# EAGLE design receiver_mini_ra02 (EAGLE 7.7.0)
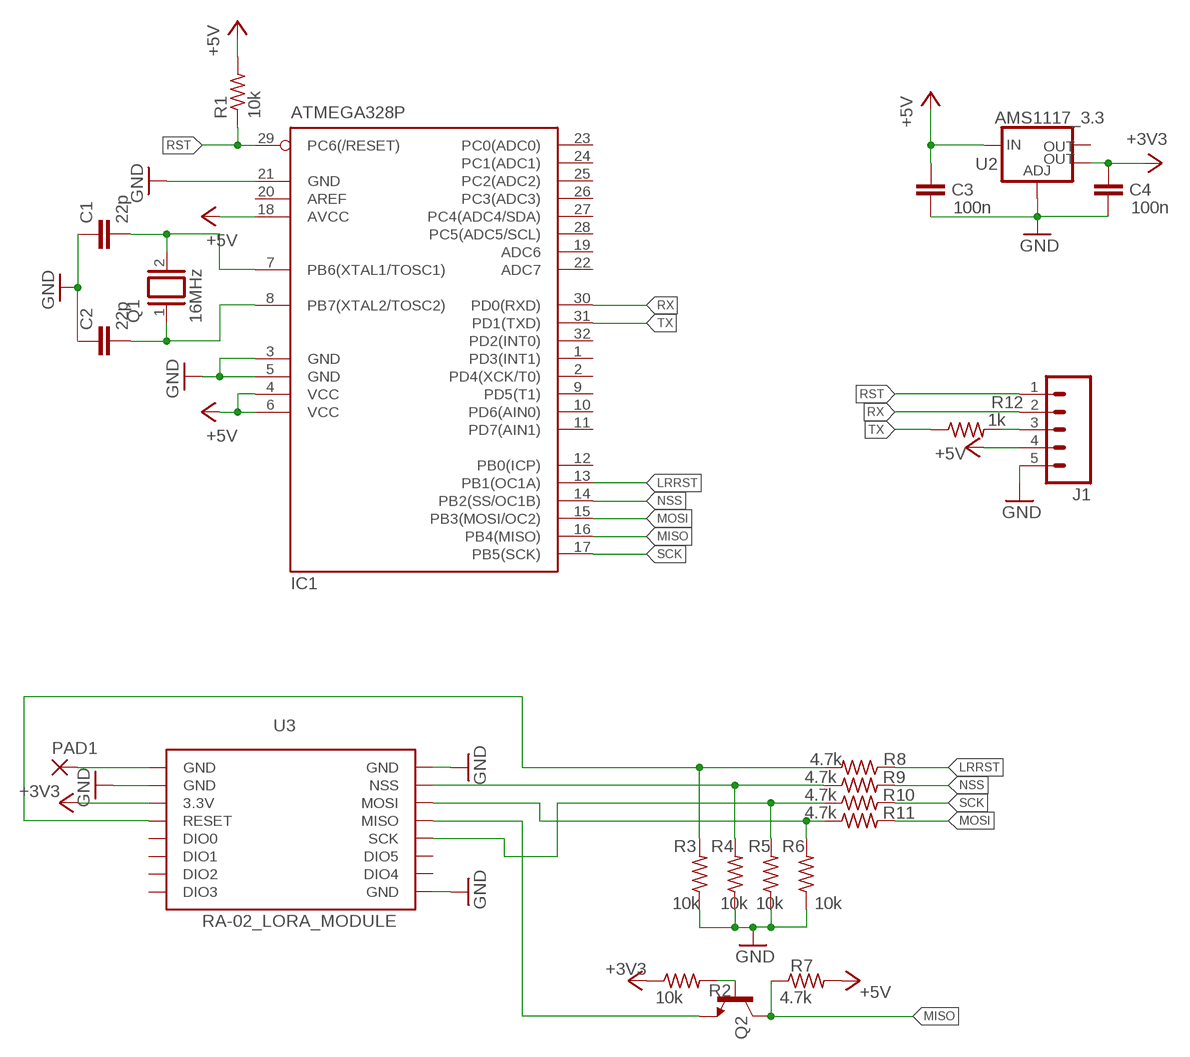
[diagram p0: schematic, sheet 1]

## Parts
C1  22p  C-EUC0805K  [C0805K]
C2  22p  C-EUC0805K  [C0805K]
C3  100n  C-EUC0805K  [C0805K]
C4  100n  C-EUC0805K  [C0805K]
IC1  ATMEGA328P  MEGA8-AI  [TQFP32-08]
J1  M05PTH  [1X05]
PAD1  2,15/1,0  [2,15/1,0]
Q1  16MHz  XTAL/S  [QS]
Q2  BC817-16SMD  [SOT23-BEC]
R1  10k  R-US_R0805  [R0805]
R2  10k  R-US_R0805  [R0805]
R3  10k  R-US_R0805  [R0805]
R4  10k  R-US_R0805  [R0805]
R5  10k  R-US_R0805  [R0805]
R6  10k  R-US_R0805  [R0805]
R7  4.7k  R-US_R0805  [R0805]
R8  4.7k  R-US_R0805  [R0805]
R9  4.7k  R-US_R0805  [R0805]
R10  4.7k  R-US_R0805  [R0805]
R11  4.7k  R-US_R0805  [R0805]
R12  1k  R-US_R0805  [R0805]
U2  AMS1117_3.3  V_REG_LM1117SOT223  [SOT223]
U3  RA-02_LORA_MODULE  [RA-02]

## Nets
+3V3: C4.2 R2.1 U2.4(OUT) U3.3.3V
+5V: C3.2 IC1.4(VCC) IC1.6(VCC) IC1.18(AVCC) J1.4 R1.2 R7.2 U2.3(IN)
GND: C1.1 C2.1 C3.1 C4.1 IC1.3(GND) IC1.5(GND) IC1.21(GND) J1.5 R3.1 R4.1 R5.1 R6.1 U2.1(ADJ) U3.GND@2(GND) U3.GND@3(GND) U3.GND@4(GND)
LRRST: IC1.13(PB1(OC1A)) R8.1
MISO: IC1.16(PB4(MISO)) Q2.C R7.1
MOSI: IC1.15(PB3(MOSI/OC2)) R11.2
N$1: C1.2 IC1.7(PB6(XTAL1/TOSC1)) Q1.2
N$2: J1.3 R12.2
N$3: C2.2 IC1.8(PB7(XTAL2/TOSC2)) Q1.1
N$4: R3.2 R8.2 U3.RESET
N$5: PAD1.1(P) U3.GND
N$6: Q2.E U3.MISO
N$7: R4.2 R9.1 U3.NSS
N$8: R5.2 R10.1 U3.SCK
N$9: R6.2 R11.1 U3.MOSI
N$33: Q2.B R2.2
NSS: IC1.14(PB2(SS/OC1B)) R9.2
RST: IC1.29(PC6(/RESET)) J1.1 R1.1
RX: IC1.30(PD0(RXD)) J1.2
SCK: IC1.17(PB5(SCK)) R10.2
TX: IC1.31(PD1(TXD)) R12.1
Unconnected: IC1.1(PD3(INT1)) IC1.2(PD4(XCK/T0)) IC1.9(PD5(T1)) IC1.10(PD6(AIN0)) IC1.11(PD7(AIN1)) IC1.12(PB0(ICP)) IC1.19(ADC6) IC1.20(AREF) IC1.22(ADC7) IC1.23(PC0(ADC0)) IC1.24(PC1(ADC1)) IC1.25(PC2(ADC2)) IC1.26(PC3(ADC3)) IC1.27(PC4(ADC4/SDA)) IC1.28(PC5(ADC5/SCL)) IC1.32(PD2(INT0)) U2.2(OUT) U3.DIO0 U3.DIO1 U3.DIO2 U3.DIO3 U3.DIO4 U3.DIO5

## Library data of the parts
C1-C4 = rcl:C-EU: CAPACITOR, European symbol
IC1 = atmel:MEGA8: MICROCONTROLLER 8 Kbytes FLASH, 1 kbytes SRAM, 512 bytes EEPROM, USART, 6-channel 10 bit ADC, 2-channel 8 bit ADC Pin compatible with Atmega48, ATMega88, ATMega168 Source: avr.lbr; MPN: ATMEGA8-16AU; OC_FARNELL: 9171371; OC_NEWARK: 73M8863
J1 = SparkFun-Connectors:M05: Header 5 Standard 5-pin 0.1" header. Use with straight break away headers (SKU : PRT-00116), right angle break away headers (PRT-00553), swiss pins (PRT-00743), machine pins (PRT-00117), and female headers (PRT-00115). Molex polarized connector foot print use with SKU : PRT-08230 with associated crimp pins and housings.
PAD1 = wirepad:2,15/1,0: THROUGH-HOLE PAD
Q1 = special:XTAL/S: CRYSTAL
Q2 = transistor-npn:BC817*: NPN Transistor
R1-R12 = rcl:R-US_: RESISTOR, American symbol
U2 = SparkFun-PowerIC:V_REG_LM1117: Voltage Regulator LM1117 Standard adjustable voltage regulator but in SMD form. Spark Fun Electronics SKU : COM-00595; PROD_ID: VREG-08170
U3 = RA-02_Lora_module:RA-02_LORA_MODULE

## Net classes
1 rf: clearance 0.5 mm

## Board
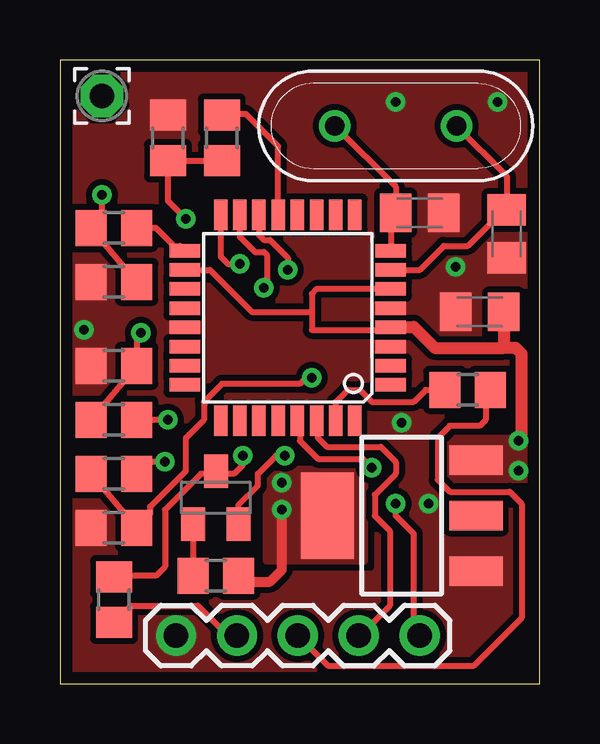
[diagram p1: board, top side]
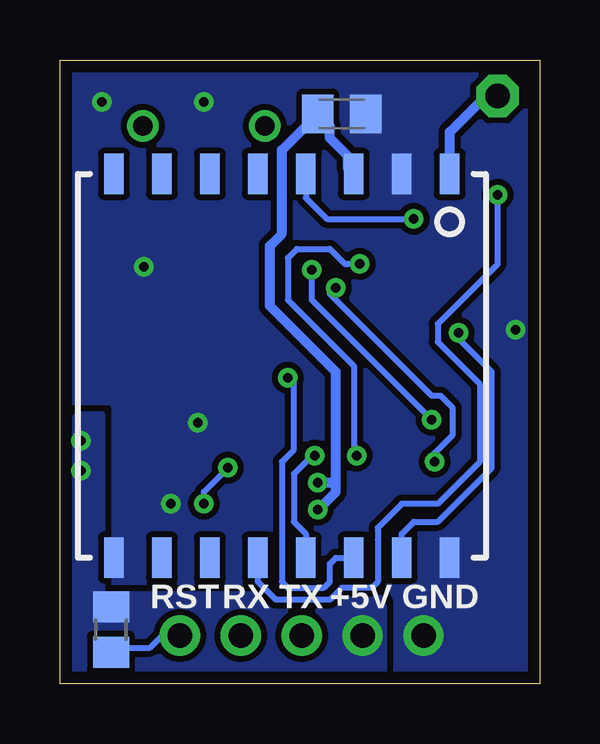
[diagram p2: board, bottom side, seen from below]

Size 20 x 26 mm. Coordinates in mm from the lower left corner, seen from the top.
Outline: 0,0 20,0 20,26 0,26 0,0
Copper layers (1*16): Top 0.035mm / dielectric 1.5mm / Bottom 0.035mm
Design rules "default *": minimum track width 0.25mm, minimum drill 0.4mm, track to track 0.25mm, track to pad 0.25mm, pad to pad 0.3mm, via to via 0.3mm, smd to smd 8mil, copper to edge 0.5mm, drill to drill 8mil, minimum pad ring 10mil, minimum via ring 8mil, stop-mask expansion 4mil, vias tented up to drill 0.8mm, thermal gap 10mil

### Footprints (pad centres in the part's own frame; a part is rotated, then mirrored left to right if it is on the bottom)
C0805K = smd 1.3 x 1.6: 1 -1,0; 2 1,0
TQFP32-08 = smd 1.27 x 0.559: 1 -4.293,2.8; 2 -4.293,2; 3 -4.293,1.2; 4 -4.293,0.4; 5 -4.293,-0.4; 6 -4.293,-1.2; 7 -4.293,-2; 8 -4.293,-2.8; 17 4.293,-2.8; 18 4.293,-2; 19 4.293,-1.2; 20 4.293,-0.4; 21 4.293,0.4; 22 4.293,1.2; 23 4.293,2; 24 4.293,2.8 | smd 0.559 x 1.27: 9 -2.8,-4.293; 10 -2,-4.293; 11 -1.2,-4.293; 12 -0.4,-4.293; 13 0.4,-4.293; 14 1.2,-4.293; 15 2,-4.293; 16 2.8,-4.293; 25 2.8,4.293; 26 2,4.293; 27 1.2,4.293; 28 0.4,4.293; 29 -0.4,4.293; 30 -1.2,4.293; 31 -2,4.293; 32 -2.8,4.293
1X05 = drill 1.016 pad 1.676: 1 0,0; 2 2.54,0; 3 5.08,0; 4 7.62,0; 5 10.16,0
2,15/1,0 = drill 1.016 pad 1.778 octagon: 1 0,0
QS = drill 0.8: 1 -2.54,0; 2 2.54,0
SOT23-BEC = smd 1 x 1.4: B -0.95,-1.1; C 0,1.1; E 0.95,-1.1
R0805 = smd 1.3 x 1.5: 1 -0.95,0; 2 0.95,0
SOT223 = smd 1.219 x 2.235: 1 -2.311,-3.099; 2 0,-3.099; 3 2.311,-3.099 | smd 3.6 x 2.2: 4 0,3.099
RA-02 = smd 1.676 x 0.813: 3.3V -8,3; DIO0 -8,-1; DIO1 -8,-3; DIO2 -8,-5; DIO3 -8,-7; DIO4 8,-5; DIO5 8,-3; GND -8,7; GND@2 -8,5; GND@3 8,-7; GND@4 8,7; MISO 8,1; MOSI 8,3; NSS 8,5; RESET -8,1; SCK 8,-1

### Placement (x,y rotation side)
C1  18.62,18.75 90 top
C2  15,19.62 180 top
C3  17.5,15.5 0 top
C4  8.25,23.75 180 bottom
IC1  9.5,15.25 180 top
J1  15,2 180 top
PAD1  1.75,24.5 0 top
Q1  14,23.25 0 top
Q2  6.5,7.75 0 top
R1  17.88,2.25 90 bottom
R2  6.5,4.5 180 top
R3  4.5,22.75 270 top
R4  2.25,13.25 0 top
R5  2.25,16.75 0 top
R6  2.25,6.5 0 top
R7  2.25,3.5 270 top
R8  6.75,22.75 270 top
R9  2.25,11 0 top
R10  2.25,19 0 top
R11  2.25,8.75 0 top
R12  17,12.25 0 top
U2  14.25,7 90 top
U3  10.75,13.25 270 bottom

### Tracks (layer width: path | path; a pad name or v marks a point on that pad's centre or on a via)
+3V3  (via drill 0.4)
  Top 0.406: R2.1 7.7,4.25 8.75,4.25 9.25,4.75 v9.25,7.25
  Bottom 0.406: v9.25,7.25 8.5,8 8.5,8.5 | 8.5,8.5 8.62,8.38 v9.25,8.38 | 8.5,8.5 8.5,13 11.25,15.75 11.25,18.25 10.75,18.75 10.75,22.25 C4.2 8.75,23.25 8.75,22.75 8,22 8,21.5 U3.3.3V
  pour Top (isolate 0.25, no thermals): 12.7,5.11 8.62,5.11 8.62,8.92 12.7,8.92
+5V  (via drill 0.4)
  Top 0.25: 13.44,15 IC1.4 13.69,14.75 10.5,14.75 10.5,15.5 | IC1.18 6.25,17.25 8,15.5 10.5,15.5 | IC1.6 10.7,16.45 10.5,16.25 10.5,15.5 | R7.2 2.95,3.25 5.75,3.25 7,2 J1.4
  Top 0.5: IC1.4 13.82,14.88 14.75,14.88 15.62,14 18.5,14 | C3.2 18.5,14 | v19.12,10.12 19.25,10.25 19.25,13.75 19,14 18.5,14
  other vias: 19.12,8.88
  pour Bottom (isolate 0.254, no thermals): 19.25,11.25 18.25,11.25 18.25,3.75 6.75,3.75 6.5,3.25 6.5,0.5 19.5,0.5 19.5,11
  pour Top (isolate 0.254, no thermals): 19.75,10.25 16.5,10.25 16.25,10 16.25,8.5 19.5,8.5 19.75,8.75
GND  (via drill 0.4)
  other vias: 16.5,17.38 14.25,10.88 15.38,7.5 1,14.75 14,24.25 18.25,24.25
  pour Top (isolate 0.25, rank 3, no thermals): 0,26 20,26 20,0 0,0
  pour Bottom (isolate 0.25, rank 3, no thermals): -0.25,26 20.25,26 20.25,0 -0.25,0
LRRST
  Top 0.25: IC1.13 9.1,22.4 7.75,23.75 6.8,23.75 R8.1
MISO  (via drill 0.4)
  Top 0.25: v7.62,9.5 7.62,9.12 7.25,8.75 6.6,8.75 | 6.6,8.75 Q2.C | 6.6,8.75 5.88,8.75 4.38,7.25 4.38,4.88 4,4.5 3.05,4.5 R7.1 | 6.7,18.55 6.7,17.8 7,17.5 v7.5,17.5
  Top 0.254: IC1.16 6.7,18.55
  Bottom 0.25: 7.75,9.75 7.75,9.62 v7.62,9.5 | 10.5,17.75 10.12,18.12 8.75,18.12 8.12,17.5 8,17.5
  Bottom 0.254: v7.5,17.5 8,17.5 | 10.5,17.75 10.5,16 7.75,13.25 7.75,9.75
MOSI  (via drill 0.4)
  Top 0.25: v4.38,9.25 3.7,9.25 R11.2 | 8.62,17.88 8.5,18 8.12,18 7.5,18.62 IC1.15
  Top 0.254: 8.62,17.88 8.62,16.62 v8.5,16.5
  Bottom 0.25: v8.5,16.5 8.75,16.25 4.5,12 4.12,12 3.62,11.5 3.62,10.38 4.38,9.62 v4.38,9.25
N$1
  Top 0.25: IC1.7 15,17.25 16,18.25 17,18.25 18.5,19.75 C1.2 18.62,21.16 Q1.2
N$2
  Top 0.25: R12.2 17.75,12.05 17.75,11 17.5,10.75 16.25,10.75 15.75,10.25 15.75,8.5 16.25,8 18.75,8 19.25,7.5 19.25,2.75 17.25,0.75 11.17,0.75 J1.3
N$3
  Top 0.25: Q1.1 14,20.71 C2.2 13.79,19.42 IC1.8
N$4  (via drill 0.4)
  Top 0.25: R8.2 R3.2 4.5,20.12 v5.25,19.38
  Bottom 0.25: U3.RESET 9.75,20.25 8.88,19.38 v5.25,19.38
N$5
  Bottom 0.406: U3.GND 3.75,23 2.25,24.5 PAD1.1
N$6  (via drill 0.4)
  Top 0.25: Q2.E 7.45,7.45 8.25,8.25 8.25,8.75 9,9.5 v9.38,9.5
  Bottom 0.25: v9.38,9.5 9.5,9.5 10.25,8.75 10.25,6.75 9.75,6.25 U3.MISO
N$7  (via drill 0.4)
  Top 0.25: R4.2 R9.1
  Top 0.254: v3.38,14.62 3.2,14.55 R4.2
  Bottom 0.25: U3.NSS 5.75,6.25 5.25,6.75 4.25,6.75 2,9 2,13 3.38,14.38 v3.38,14.62
N$8  (via drill 0.4)
  Top 0.25: R10.1 R5.2
  Top 0.254: R10.1 1.75,19.45 v1.75,20.38
  Bottom 0.25: 6.75,4.25 7,4 8.25,4 8.75,3.5 11,3.5 11.75,4.25 U3.SCK | 6.75,6 6.75,6.5 5.75,7.5 4.25,7.5 2.5,9.25 2.5,12.5 4.25,14.25 4.25,15 1.75,17.5 v1.75,20.38
  Bottom 0.254: 6.75,6.38 6.75,6 6.75,4.25
N$9  (via drill 0.4)
  Top 0.25: R11.1 R6.2 3.75,7.05 3.75,7.38 5.25,8.88 5.25,10.25 5.38,10.38 | v10.5,12.75 10.25,12.75 10,12.5 6.75,12.5 6,11.75
  Top 0.254: 6,11.75 6,11 5.38,10.38
  Bottom 0.25: v10.5,12.75 10.25,12.5 10.25,9.75 10.75,9.25 10.75,4.25 10.5,4 9,4 8.75,4.25 8.75,5 8.5,5.25 U3.MOSI
N$33
  Top 0.25: Q2.B R2.2
NSS  (via drill 0.4)
  Top 0.25: IC1.14 8.3,18.7 8.5,18.5 8.75,18.5 9.5,17.75
  Top 0.254: IC1.14 8.25,19.74 | 9.5,17.75 v9.5,17.25 | v4.5,11 R9.2
  Bottom 0.25: v4.5,11 9.5,16 v9.5,17.25
RST  (via drill 0.4)
  Top 0.25: IC1.29 10,10.86 10,10.12 10.75,9.38 12.62,9.38 v13,9 | J1.1 14.75,2.25 14.75,6.25 14,7 v14,7.5
  Bottom 0.25: R1.1 17.68,1.5 16.25,1.5 15.75,2 J1.1 | v14,7.5 14,8 v13,9
RX
  Top 0.25: IC1.30 10.75,10.91 10.75,10.25 11.12,9.88 13.38,9.88 14,9.25 14,8.75 13.12,7.88 13.12,7 13.75,6.38 13.75,3.25 12.5,2 J1.2
SCK
  Top 0.25: R10.2 4,19 4.75,18.25 5.01,18.25 IC1.17
TX
  Top 0.25: IC1.31 11.5,11.75 12,12.25 12.5,12.25 13,11.75 14.75,11.75 15.25,12.25 R12.1

### Text on the board
bPlace: GND | +5V | TX | RX | RST